# EAGLE design iBeacon (EAGLE 6.4)
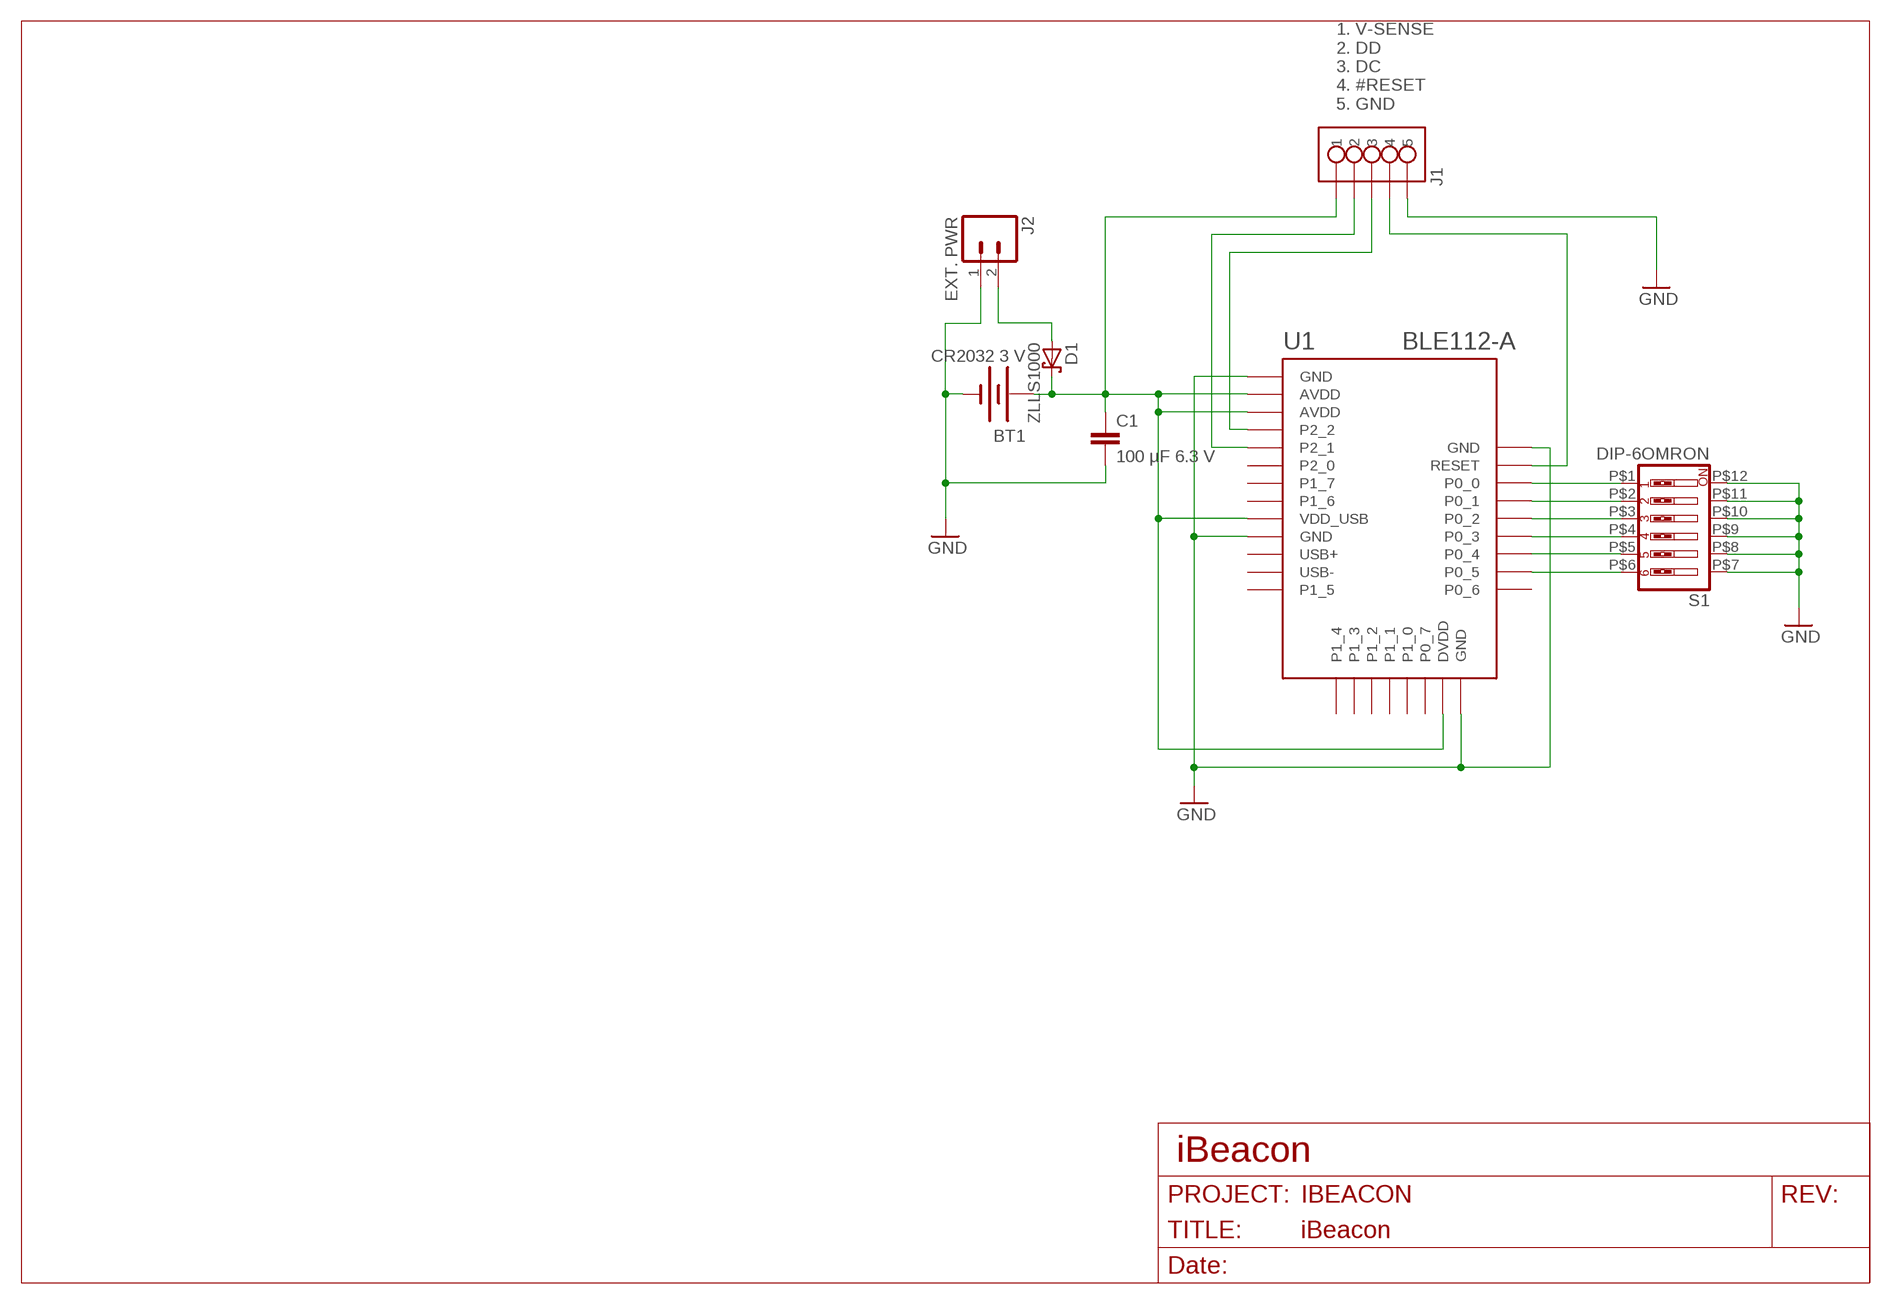
[diagram p0: schematic, sheet 1]

## Parts
BT1  CR2032 3 V  BATTERY20SMD  [BATTCON_20MM]
C1  100 µF 6.3 V  C-EUC1210K  [C1210K]
D1  ZLLS1000  BAS40  [SOT23]
IBEACON  iBeacon  DOCFIELD_JWJ  [DOCFIELD]
J1  JST_SH_5  [JST_SH_5]
J2  EXT. PWR  M02PTH  [1X02]
S1  DIP-6OMRON  [OMRON_HALFPITCH_DIP_6]
U1  BLE112-A  SF-BLUEGIGA_BLE112-A-VISUAL  [SF-BLUEGIGA_BLE112-A]

## Nets
3V: BT1.1(+) BT1.3(+) C1.1 D1.3(C) J1.P$1 U1.AVDD1(AVDD) U1.AVDD2(AVDD) U1.DVDD U1.VDD_USB
DC: J1.P$3 U1.P2_2
DD: J1.P$2 U1.P2_1
GND: BT1.2(-) C1.2 J1.P$5 J2.1 S1.P$7 S1.P$8 S1.P$9 S1.P$10 S1.P$11 S1.P$12 U1.GND1(GND) U1.GND2(GND) U1.GND3(GND) U1.GND4(GND)
N$1: S1.P$1 U1.P0_0
N$2: S1.P$2 U1.P0_1
N$6: S1.P$3 U1.P0_2
N$7: S1.P$4 U1.P0_3
N$8: S1.P$5 U1.P0_4
N$9: S1.P$6 U1.P0_5
N$10: D1.1(A) J2.2
RST: J1.P$4 U1.RESET
Unconnected: U1.P0_6 U1.P0_7 U1.P1_0 U1.P1_1 U1.P1_2 U1.P1_3 U1.P1_4 U1.P1_5 U1.P1_6 U1.P1_7 U1.P2_0 U1.USB+ U1.USB-

## Notes on the sheet
- 1. V-SENSE
  2. DD
  3. DC
  4. #RESET
  5. GND

## Library data of the parts
BT1 = SparkFun-Electromechanical:BATTERY: Battery Holders Various common sizes : AA, AAA, 20mm coin cell and 12mm coin cell.
C1 = rcl:C-EU: CAPACITOR, European symbol
D1 = diode:BAS40: Silicon Schottky Diodes General-purpose diode for high-speed switching
IBEACON = jenswilly_custom:DOCFIELD_JWJ
J1 = jenswilly_custom:JST_SH_5: JST SH series
J2 = SparkFun-Connectors:M02: Header 2 Standard 2-pin 0.1" header. Use with straight break away headers (SKU : PRT-00116), right angle break away headers (PRT-00553), swiss pins (PRT-00743), machine pins (PRT-00117), and female headers (PRT-00115). Molex polarized connector foot print use with SKU : PRT-08233 with associated crimp pins and housings.
S1 = jenswilly_custom:DIP-6: DIP switch
U1 = jenswilly_custom:SF-BLUEGIGA_BLE112-A-VISUAL: Bluetooth Low Energy single-mode module - Bluetooth 4.0, chip antenna

## Board
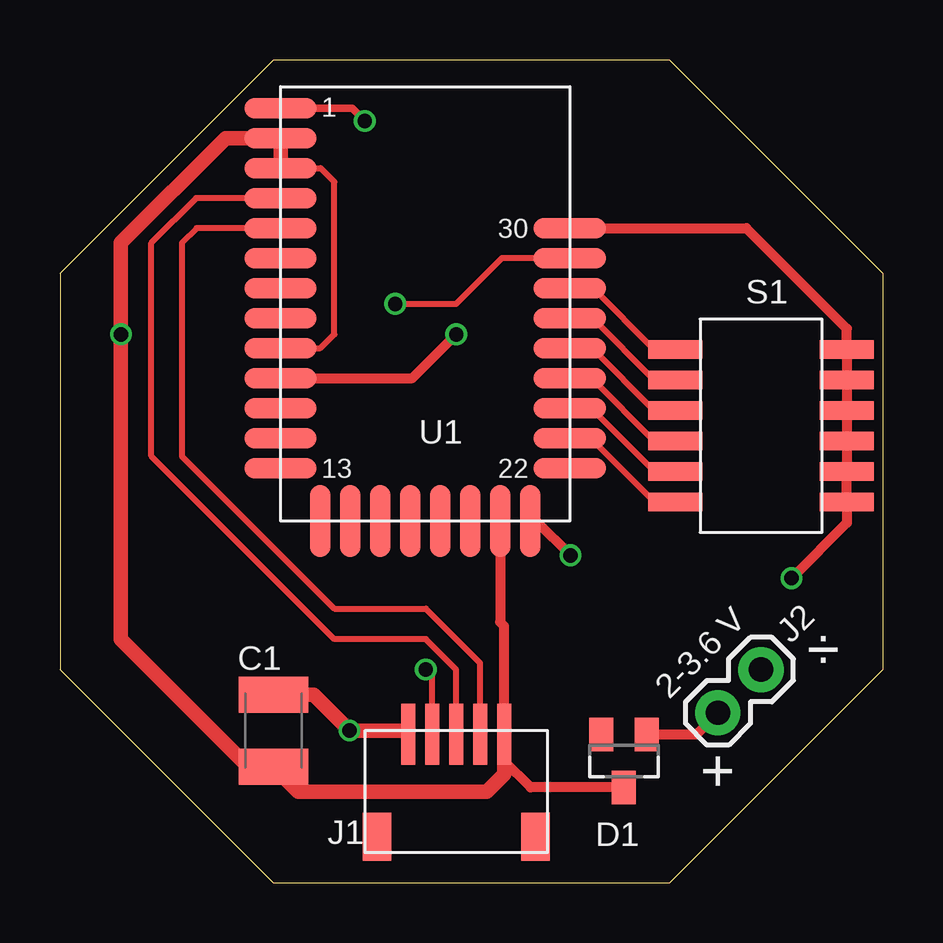
[diagram p1: board, top side]
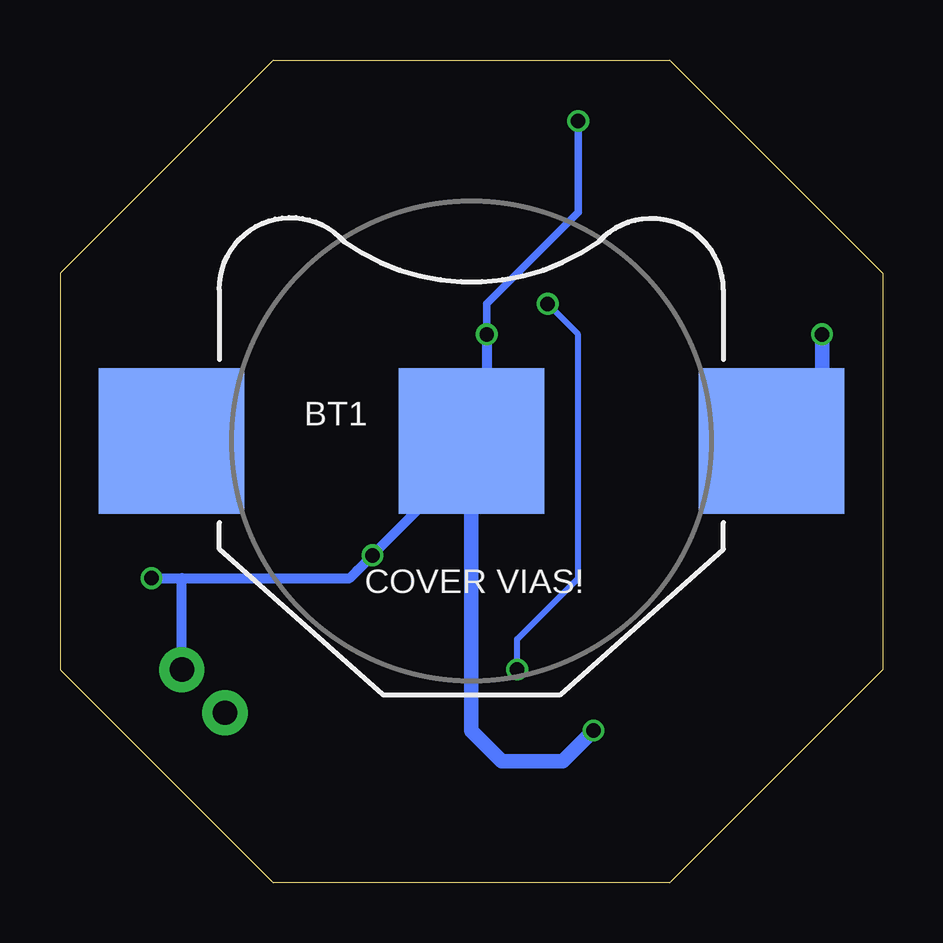
[diagram p2: board, bottom side, seen from below]

Size 34.29 x 34.29 mm. Coordinates in mm from the lower left corner, seen from the top.
Outline: 25.4,34.29 8.89,34.29 0,25.4 0,8.89 8.89,0 25.4,0 34.29,8.89 34.29,25.4
Outline: 25.4,34.29 34.29,25.4
Outline: 25.4,34.29 34.29,25.4
Outline: 25.4,34.29 34.29,25.4
Copper layers (1*16): Top 0.035mm / dielectric 1.5mm / Bottom 0.035mm
Design rules "ITEADstudio_DRC": minimum track width 6mil, minimum drill 12mil, track to track 6mil, track to pad 6mil, pad to pad 6mil, via to via 6mil, smd to smd 0mil, copper to edge 10mil, drill to drill 10mil, minimum pad ring 10mil, minimum via ring 6mil, stop-mask expansion 2mil, vias tented up to drill 100mil, thermal gap 10mil

### Footprints (pad centres in the part's own frame; a part is rotated, then mirrored left to right if it is on the bottom)
BATTCON_20MM = smd 6.07 x 6.07: 1 -12.5,0; 2 0,0; 3 12.5,0
C1210K = smd 1.5 x 2.9: 1 -1.5,0; 2 1.5,0
SOT23 = smd 1 x 1.4: 1 -0.95,-1.1; 2 0.95,-1.1; 3 0,1.1
JST_SH_5 = smd 0.6 x 2.55: P$1 2,2.388; P$2 1,2.388; P$3 0,2.388; P$4 -1,2.388; P$5 -2,2.388 | smd 1.2 x 2: P$6 3.3,-1.887; P$7 -3.3,-1.887
1X02 = drill 1.016 pad 1.88: 1 0,0; 2 2.54,0
OMRON_HALFPITCH_DIP_6 = smd 0.76 x 2.25: P$1 -2.54,-3.575; P$2 -1.27,-3.575; P$3 0,-3.575; P$4 1.27,-3.575; P$5 2.54,-3.575; P$6 3.81,-3.575; P$7 3.81,3.575; P$8 2.54,3.575; P$9 1.27,3.575; P$10 0,3.575; P$11 -1.27,3.575; P$12 -2.54,3.575
SF-BLUEGIGA_BLE112-A = smd 3 x 0.85: AVDD1 -6.05,6.9; AVDD2 -6.05,5.65; GND1 -6.05,8.15; GND2 -6.05,-3.1; GND4 6,3.15; P0_0 6,0.65; P0_1 6,-0.6; P0_2 6,-1.85; P0_3 6,-3.1; P0_4 6,-4.35; P0_5 6,-5.6; P0_6 6,-6.85; P1_5 -6.05,-6.85; P1_6 -6.05,-0.6; P1_7 -6.05,0.65; P2_0 -6.05,1.9; P2_1 -6.05,3.15; P2_2 -6.05,4.4; RESET 6,1.9; USB+ -6.05,-4.35; USB- -6.05,-5.6; VDD_USB -6.05,-1.85 | smd 0.85 x 3: DVDD 3.1,-9.05; GND3 4.35,-9.05; P0_7 1.85,-9.05; P1_0 0.6,-9.05; P1_1 -0.65,-9.05; P1_2 -1.9,-9.05; P1_3 -3.15,-9.05; P1_4 -4.4,-9.05

### Placement (x,y rotation side)
BT1  17.14,18.41 0 bottom
C1  8.89,6.35 90 top
D1  23.5,5.08 180 top
IBEACON  1.27,10.16 0 top
J1  16.51,3.81 0 top
J2  29.21,8.89 225 top
S1  29.21,19.68 270 top
U1  15.24,24.13 0 top

### Tracks (layer width: path | path; a pad name or v marks a point on that pad's centre or on a via)
3V  (via drill 0.6)
  Top 0.254: U1.VDD_USB 10.85,22.28 11.43,22.86 11.43,29.21 10.86,29.78 U1.AVDD2
  Top 0.406: U1.DVDD 18.34,10.87 18.51,10.7 J1.P$1 | D1.3 19.61,3.98 18.51,5.08
  Top 0.61: U1.AVDD2 U1.AVDD1 6.9,31.03 2.54,26.67 v2.54,22.86 2.54,10.16 7.62,5.08 8.66,5.08 C1.1 9.93,3.81 17.78,3.81 18.51,4.54 18.51,5.08 J1.P$1
  Bottom 0.61: v2.54,22.86 2.54,20.52 BT1.3
DC
  Top 0.254: J1.P$3 16.51,8.89 15.24,10.16 11.43,10.16 3.81,17.78 3.81,26.67 5.67,28.53 U1.P2_2
DD
  Top 0.254: J1.P$2 17.51,9.16 15.24,11.43 11.43,11.43 5.08,17.78 5.08,26.67 5.69,27.28 U1.P2_1
GND  (via drill 0.6)
  Top 0.305: U1.GND1 12.17,32.28 v12.7,31.75
  Top 0.406: U1.GND4 28.6,27.28 32.78,23.09 S1.P$12 S1.P$11 S1.P$10 S1.P$9 S1.P$8 S1.P$7 32.78,15.01 v30.48,12.7 | U1.GND2 14.68,21.03 v16.51,22.86 | U1.GND3 19.84,15.08 v21.27,13.65
  Top 0.61: C1.2 10.56,7.85 v12.06,6.35 14.36,6.35 J1.P$5
  Bottom 0.305: v12.7,31.75 12.7,27.94 16.51,24.13 16.51,19.05
  Bottom 0.406: v16.51,22.86 16.51,19.05 16.51,18.41 17.14,17.78 v21.27,13.65 21.91,13.02 22.23,12.7 29.21,12.7 | v30.48,12.7 29.21,12.7 | J2.1 29.21,12.7
  Bottom 0.61: BT1.2 17.14,17.78 17.14,6.35 15.88,5.08 13.34,5.08 v12.06,6.35
N$1
  Top 0.254: U1.P0_0 22.21,24.78 24.77,22.23 S1.P$1
N$2
  Top 0.254: U1.P0_1 22.19,23.53 24.77,20.95 S1.P$2
N$6
  Top 0.254: U1.P0_2 22.17,22.28 24.77,19.68 S1.P$3
N$7
  Top 0.254: U1.P0_3 22.15,21.03 24.77,18.41 S1.P$4
N$8
  Top 0.254: U1.P0_4 22.13,19.78 24.77,17.14 S1.P$5
N$9
  Top 0.254: U1.P0_5 22.11,18.53 24.77,15.88 S1.P$6
N$10
  Top 0.406: J2.2 26.5,6.18 D1.1
RST  (via drill 0.6)
  Top 0.254: J1.P$4 15.51,8.62 v15.24,8.89 | v13.97,24.13 16.51,24.13 18.41,26.03 U1.RESET
  Bottom 0.254: v15.24,8.89 15.24,10.16 12.7,12.7 12.7,22.86 v13.97,24.13

### Text on the board
tPlace: ÷ | 2-3.6 V | +
bPlace: COVER VIAS!